# Altium schematic sheet SH-C30L-V1.0.SchDoc
size 420 x 298 mm; Symbol: Sheet-Symbol_A3; Company: DSD TECH; @Page No: 1; @Page Name: P1; @Project Name: SH-C30L; @Page Count: 1; @Update Date: 2024-11-15; @Create Date: 2024-11-15; @Schematic Name: CANable_V1.0; Device: Sheet-Symbol_A3; @Board Name: SH-C30L-V1.0-20241115; @Create Time: 15:35:04; @Update Time: 15:35:04
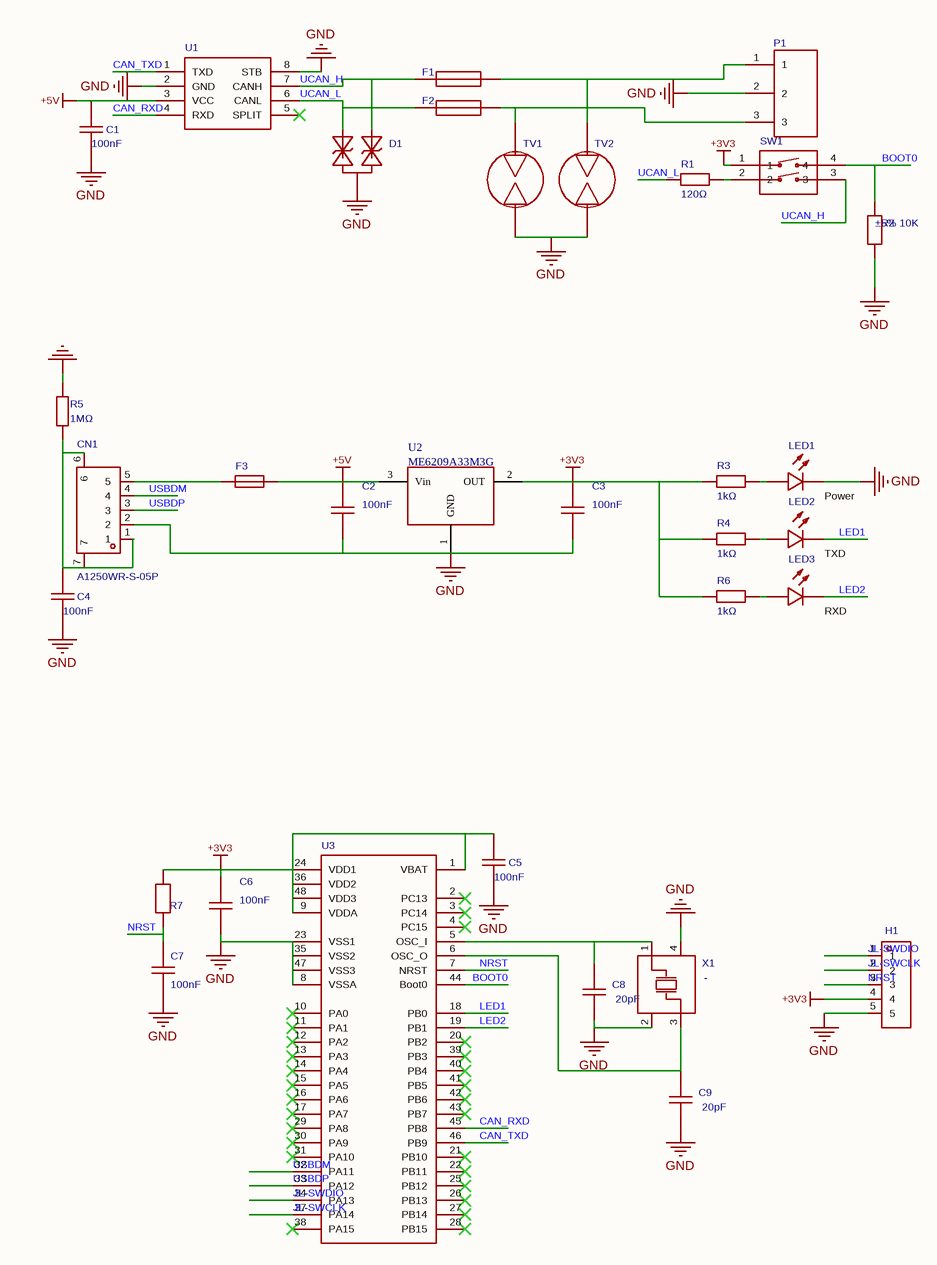
[diagram p0: SH-C30L-V1.0.SchDoc]

## Parts
C1  value 100nF  [C0402]
C2  value 100nF  [C0402]
C3  value 100nF  [C0402]
C4  value 100nF  [C0402]
C5  value 100nF  [C0402]
C6  value 100nF  [C0402]
C7  value 100nF  [C0402]
C8  value 20pF  [C0402]
C9  value 20pF  [C0402]
CN1  A1250WR-S-05P  [CONN-SMD_HF-P1.25-5P]
D1  (no value)  [SOT-23-3_L2.9-W1.3-P1.90-LS2.4-BR]
F1  (no value)  [F1206]
F2  (no value)  [F1206]
F3  (no value)  [F0805]
H1  (no value)  [HDR-TH_5P-P2.54-V-M]
LED1  (no value)  [LED0603-RD_RED]
LED2  (no value)  [LED0603-RD]
LED3  (no value)  [LED0603-RD]
P1  (no value)  [CONN-TH_3P-P3.81_WJ124-3.81-3P]
R1  value 120Ω  [R0805]
R2  LCSC Part Name: ±5% 10K  [R0402]
R3  value 1kΩ  [R0402]
R4  value 1kΩ  [R0402]
R5  value 1MΩ  [R0603]
R6  value 1kΩ  [R0402]
R7  (no value)  [R0402]
SW1  (no value)  [SW-SMD_4P-L6.5-W6.0-P2.54-LS9.8]
TV1  (no value)  [DIO-DT-SMD_L4.5-W3.2]
TV2  (no value)  [DIO-DT-SMD_L4.5-W3.2]
U1  (no value)  [SOIC-8_L5.0-W4.0-P1.27-LS6.0-BL]
U2  ME6209A33M3G  [SOT-23(SOT-23-3)]
U3  (no value)  [LQFP-48_L7.0-W7.0-P0.50-LS9.0-BL]
X1  (no value)  [OSC-SMD_4P-L3.2-W2.5-BL]

## Nets
+3V3: C3.2 C5.2 C6.2 H1.4 R3.1 R4.1 R6.1 R7.2 SW1.1 U2.2(OUT) U3.1(VBAT) U3.9(VDDA) U3.24(VDD1) U3.36(VDD2) U3.48(VDD3)
+5V: C1.2 C2.2 F3.2 U1.3(VCC) U2.3(Vin)
GND: C1.1 C2.1 C3.1 C4.1 C5.1 C6.1 C7.1 C8.2 C9.1 CN1.2 D1.3 H1.5 LED1.1(K) P1.2 R2.1 R5.1 TV1.2 TV2.2 U1.2(GND) U1.8(STB) U2.1(GND) U3.8(VSSA) U3.23(VSS1) U3.35(VSS2) U3.47(VSS3) X1.2(GND) X1.4(GND)
BOOT0: R2.2 SW1.4 U3.44(Boot0)
CAN_RXD: U1.4(RXD) U3.45(PB8)
CAN_TXD: U1.1(TXD) U3.46(PB9)
JL-SWCLK: H1.2 U3.37(PA14)
JL-SWDIO: H1.1 U3.34(PA13)
LED1: LED2.1(K) U3.18(PB0)
LED2: LED3.1(K) U3.19(PB1)
NRST: C7.2 H1.3 R7.1 U3.7(NRST)
UCAN_H: D1.1 F1.1 SW1.3 U1.7(CANH)
UCAN_L: D1.2 F2.1 R1.1 U1.6(CANL)
USBDM: CN1.4 U3.32(PA11)
USBDP: CN1.3 U3.33(PA12)
NetC4_2: C4.2 CN1.1 CN1.6 CN1.7 R5.2
NetC8_1: C8.1 U3.5(OSC_I) X1.1(OSC1)
NetC9_2: C9.2 U3.6(OSC_O) X1.3(OSC2)
NetCN1_5: CN1.5 F3.1
NetF1_2: F1.2 P1.1 TV2.1
NetF2_2: F2.2 P1.3 TV1.1
NetLED1_2: LED1.2(A) R3.2
NetLED2_2: LED2.2(A) R4.2
NetLED3_2: LED3.2(A) R6.2
NetR1_2: R1.2 SW1.2

Not connected (* = marked no-connect by the designer): U1 5(SPLIT)*; U3 2(PC13)* 3(PC14)* 4(PC15)* 10(PA0)* 11(PA1)* 12(PA2)* 13(PA3)* 14(PA4)* 15(PA5)* 16(PA6)* 17(PA7)* 20(PB2)* 21(PB10)* 22(PB11)* 25(PB12)* 26(PB13)* 27(PB14)* 28(PB15)* 29(PA8)* 30(PA9)* 31(PA10)* 38(PA15)* 39(PB3)* 40(PB4)* 41(PB5)* 42(PB6)* 43(PB7)*

## Notes on the sheet
- (near LED1) Power
- (near LED2) TXD
- (near LED3) RXD
- Update Date
- 2024-11-15
- Schematic
- Page
- CANable_V1.0
- P1
- Create Date
- Part Number
- Reviewed
- Drawed
- SH-C30L
- VER
- SIZE
- PAGE
- 1
- DSD TECH
- OF

## Library data of the parts
C1-C7 = C0402X104K050T: Capacitance:100nF;Tolerance:±10%;Rated Voltage:50V;Temp. Coefficient:X7R;; Manufacturer: IHHEC; AddInBom: yes; ModelId: 36a51122f27c49738f86b3bfa98863e0; ModelName: C0402_L1.0-W0.5-H0.5; ModelTransform: 39.37,19.685,0,0,0,0,0,0,0; Tolerance: ±10%; Voltage Rated: 50V; Temperature Coefficient: X7R; Device: C0402X104K050T; Symbol: C0402X104K050T; LCSC Part Name: 100nF ±10% 50V; SupplierPart: C501838; ManufacturerPart: C0402X104K050T; Supplier Footprint: 0402; JLCPCB Part Class: Extended Part; Datasheet: https://atta.szlcsc.com/upload/public/pdf/source/20190313/C374174_331C86E4A68CC9C732DA87186AAF7F8A.pdf; Supplier: LCSC; ConvertToPcb: yes; FootprintName: C0402
C8 C9 = GRM1555C1H200JA01D: Capacitance:20pF;Tolerance:±5%;Rated Voltage:50V;Temp. Coefficient:C0G;; Manufacturer: muRata; AddInBom: yes; ModelId: 36a51122f27c49738f86b3bfa98863e0; ModelName: C0402_L1.0-W0.5-H0.5; ModelTransform: 39.37,19.685,0,0,0,0,0,0,0; Tolerance: ±5%; Voltage Rated: 50V; Temperature Coefficient: C0G; Device: GRM1555C1H200JA01D; Symbol: GRM1555C1H200JA01D; LCSC Part Name: 20pF ±5% 50V; SupplierPart: C76959; ManufacturerPart: GRM1555C1H200JA01D; Supplier Footprint: 0402; JLCPCB Part Class: Extended Part; Datasheet: https://atta.szlcsc.com/upload/public/pdf/source/20180307/C76959_15204091273971407747.pdf; Supplier: LCSC; ConvertToPcb: yes; FootprintName: C0402
CN1 = A1250WR-S-05P: Pin Configuration:1x5P;Pitch:1.25mm;Mounting:-;Reference Series:-;Total Pins:5P;Rows:1;Pins per Row:5;Row Spacing:-;Contact Material:Phosphor Bronze;; Manufacturer: HR; AddInBom: yes; ModelId: 1add2430d4ef47bf9b16807c94307513; ModelName: CONN-SMD_MX1.25-WS-5P; ModelTransform: 448.818,204.3303,0,0,0,0,0,-31.496,0; Pins Structure: 1x5P; Pitch: 1.25mm; Number of PINs Per Row: 5; Symbol: A1250WR-S-05P; Device: A1250WR-S-05P; LCSC Part Name: Pitch:1.25mm 1x5P; SupplierPart: C267482; ManufacturerPart: A1250WR-S-05P; Supplier Footprint: SMD,P=1.25mm; JLCPCB Part Class: Extended Library; Datasheet: https://atta.szlcsc.com/upload/public/pdf/source/20180810/C267488_FB35E328194EC1D336731540BB5C61F9.pdf; Supplier: LCSC; ConvertToPcb: yes; FootprintName: CONN-SMD_HF-P1.25-5P; Mounting Style: -; Reference Series: -; Number of Pins: 5P; Number of Rows: 1; Row Spacing: -; Contact Material: Phosphor Bronze
D1 = TPPESD12VL2BT: Manufacturer: TECH PUBLIC; AddInBom: yes; ModelId: c62791f0466c4ae2a892c056b845b0ca; ModelName: SOT-23-3P_L2.9-W1.3-H1.0-LS2.4-P0.95; ModelTransform: 98.425,114.173,0,180,0,0,0.0005,-0.0005,0; Device: TPPESD12VL2BT; Symbol: TPPESD12VL2BT; LCSC Part Name: TPPESD12VL2BT; SupplierPart: C2682273; ManufacturerPart: TPPESD12VL2BT; Supplier Footprint: SOT-23-3; JLCPCB Part Class: Extended Part; Datasheet: https://atta.szlcsc.com/upload/public/pdf/source/20210810/22D0EE7AE03C1C968B9C50DDF599EB08.pdf; Supplier: LCSC; ConvertToPcb: yes; FootprintName: SOT-23-3_L2.9-W1.3-P1.90-LS2.4-BR
F1 F2 = BSMD1206-020-24V: Max Voltage:24V;Hold Current:200mA;Max Current:40A;Power Dissipation:600mW;Operating Temp.:-40~+85;Trip Current:460mA;Initial Resistance (min):350mΩ;Max Trip Time:100ms;Post-trip Resistance (max):2.7Ω;; Manufacturer: BHFUSE; AddInBom: yes; ModelId: f1628daad26847a79b887277a2bc8541; ModelName: F1206_L3.2-W1.7-H0.6; ModelTransform: 126,66.9,0,0,0,0,0,0,0; Operating Voltage (Max): 24V; Hold Current: 200mA; Current Rating (Max): 40A; Power Dissipation: 600mW; Trip Current: 460mA; Resistance - Initial (Ri) (Min): 350mΩ; Maximum Time to Trip: 100ms; Resistance - Post Trip (R1) (Max): 2.7Ω; Operating Temperature: -40~+85; Device: BSMD1206-020-24V; Symbol: BSMD1206-020-24V; LCSC Part Name: 1206 0.2A 24V; SupplierPart: C883117; ManufacturerPart: BSMD1206-020-24V; Supplier Footprint: 1206; JLCPCB Part Class: Extended Part; Datasheet: https://atta.szlcsc.com/upload/public/pdf/source/20210323/C976306_14EC47BF6884C9FF1739F1E3CC0B530C.pdf; Supplier: LCSC; ConvertToPcb: yes; FootprintName: F1206
F3 = FSMD010-24-0805-R: Max Voltage:24V;Max Current:100A;Hold Current:100mA;Trip Current:300mA;; Manufacturer: FUZETEC; AddInBom: yes; ModelId: 57e2aa106f9143e8b6ab832aebb31c78; ModelName: F0805_L2.1-W1.4-H0.8; ModelTransform: 82.677,55.118,0,0,0,0,0.0005,0,0; Operating Voltage (Max): 24V; Current Rating (Max): 100A; Hold Current: 100mA; Trip Current: 300mA; Device: FSMD010-24-0805-R; Symbol: FSMD010-24-0805-R; LCSC Part Name: 0.1A 24V resettable fuse; SupplierPart: C220142; ManufacturerPart: FSMD010-24-0805-R; Supplier Footprint: 0805; JLCPCB Part Class: Extended Part; Datasheet: https://atta.szlcsc.com/upload/public/pdf/source/20180530/C220142_CDCC5931C174CCAFFDB29D784E09FABB.PDF; Supplier: LCSC; ConvertToPcb: yes; FootprintName: F0805
H1 = PZ254V-11-05P: Pitch:2.54mm;Total Pins:5;Rows:1;Pin Configuration:1x5P;Row Spacing:-;Mounting Type:Through Hole;Round Pin/Square Pin:Square Pin;Rated Current:-;Rated Voltage:-;Mating Pin Length:6mm;Insulator Height:2.5mm;Termination Pin Length:3mm;Contact Material:Brass;Contact Plating:-;Operating Temp. Range:-40~+105;Color:Black;; Manufacturer: XFCN; AddInBom: yes; ModelId: 47d466e4a34f4fc5bc626cf773a24dd5; ModelName: HDR-TH_5P-P2.54-M-LI-1X5P; ModelTransform: 499.999,100,0,0,0,0,0,0,-118.11; Pitch: 2.54mm; Pin Structure: 1x5P; Operating Temperature Range: -40~+105; Device: PZ254V-11-05P; Symbol: PZ254V-11-05P; LCSC Part Name: 2.54mm 1x5P; SupplierPart: C492404; ManufacturerPart: PZ254V-11-05P; Supplier Footprint: Through Hole,P=2.54mm; JLCPCB Part Class: Extended Part; Datasheet: https://atta.szlcsc.com/upload/public/pdf/source/20200309/C492404_E51533260F8710EFF5D4617281164C1D.pdf; Supplier: LCSC; ConvertToPcb: yes; FootprintName: HDR-TH_5P-P2.54-V-M; Number of Pins: 5; Number of Rows: 1; Row Spacing: -; Mounting Type: Through Hole; Circluar Pins/Square Pins: Square Pin; Current Rating (Max): -; Voltage Rating (Max): -; Length of Mating Pin: 6mm; Insulation Height: 2.5mm; Length of End Connection Pin: 3mm; Contact Material: Brass; Contact Plating: -; Color: Black
LED1 = NCD0603R1_C84263: Emitted Color:Red;; Manufacturer: NationStar; Symbol: FC-DA1608HRK-620D; AddInBom: yes; ModelId: 74041d3a270d435c8600a9ab9b7641c0; ModelTransform: 63.7794,31.496,0,0,0,0,0,0,0; Emitted Color: Red; Device: NCD0603R1_C84263; LCSC Part Name: Red; SupplierPart: C84263; ManufacturerPart: NCD0603R1; Supplier Footprint: 0603; JLCPCB Part Class: Extended Part; Datasheet: https://atta.szlcsc.com/upload/public/pdf/source/20200820/C84263_DABC6A75E58F576973B407FDBA283D60.pdf; Supplier: LCSC; ConvertToPcb: yes; FootprintName: LED0603-RD_RED; ModelName: LED0603-RD_RED
LED2 LED3 = NCD0603G1: Emitted Color:Emerald Green;; Manufacturer: NationStar; Symbol: FC-D1608UGK-520D10; AddInBom: yes; ModelId: 1f0d29a91be547639d425604e9b96ebb; ModelTransform: 63.7794,32.283,0,0,0,0,0,0,0; Device: NCD0603G1; LCSC Part Name: Emerald Green; SupplierPart: C84267; ManufacturerPart: NCD0603G1; Supplier Footprint: 0603; JLCPCB Part Class: Extended Part; Datasheet: https://atta.szlcsc.com/upload/public/pdf/source/20200820/C84267_04BA7703640BAC111D09F5EFB971FBF3.pdf; Supplier: LCSC; ConvertToPcb: yes; FootprintName: LED0603-RD; ModelName: LED0603-RD; Emitted Color: Emerald Green
P1 = WJ124-3.81-3P: Pitch:3.81mm;Rows:1;Pins per Row:3;Mounting:Straight;Rated Current:15A;Rated Voltage:300V;Wire Gauge - AWG:14~30;Wire Gauge - mm?:1.5;Operating Temp. Range:-40~+105;Color:Green;; Manufacturer: KANGNEX; AddInBom: yes; ModelId: 09065bb11f2443318818d6a3b154f95c; ModelName: CONN-TH_WJ3.81-LI-3P-124; ModelTransform: 469.7,287.4,0,90,0,0,2,-9.8,-157.5; Pitch: 3.81mm; Number of PINs Per Row: 3; Current Rating (Max): 15A; Voltage Rating (Max): 300V; Wire Gauge - AWG: 14~30; Wire Gauge - mm?: 1.5; Operating Temperature Range: -40~+105; Device: WJ124-3.81-3P; Symbol: WJ124-3.81-3P; LCSC Part Name: 3.81mm Rows:1 Pins per Row:3 Straight stackable; SupplierPart: C36780; ManufacturerPart: WJ124-3.81-3P; Supplier Footprint: P=3.81mm; JLCPCB Part Class: Extended Part; Datasheet: https://atta.szlcsc.com/upload/public/pdf/source/20191225/C36780_C6A965E5CD5B8ACE599A8EDC0C9E48CC.pdf; Supplier: LCSC; ConvertToPcb: yes; FootprintName: CONN-TH_3P-P3.81_WJ124-3.81-3P; Number of Rows: 1; Mounting Style: Straight; Color: Green
R1 = TC0525F1200T5E: Resistor Type:Thin Film Resistor;Resistance:120Ω;Tolerance:±1%;Power:250mW;Temp. Coefficient:±25ppm/;Max Working Voltage:150V;Operating Temp. Range:-55~+155;; Manufacturer: UNI-ROYAL; Temperature Coefficient: ±25ppm/; AddInBom: yes; ModelId: 37a81e68749a4138bd2dfa6897b24b85; ModelName: R0805_L2.0-W1.3-H0.6; ModelTransform: 78.74,51.181,0,0,0,0,0,-0.0005,0; Tolerance: ±1%; Power(Watts): 250mW; Overload Voltage (Max): 150V; Operating Temperature Range: -55~+155; Device: TC0525F1200T5E; Symbol: TC0525F1200T5E; LCSC Part Name: 120Ω ±1%; SupplierPart: C61683; ManufacturerPart: TC0525F1200T5E; Supplier Footprint: 0805; JLCPCB Part Class: Extended Part; Datasheet: https://atta.szlcsc.com/upload/public/pdf/source/20190404/C61683_83EF7BF6E2DB2C00969A8D3769A56445.pdf; Supplier: LCSC; ConvertToPcb: yes; FootprintName: R0805; Type: Thin Film Resistor
R2 R7 = SCR0402J10K: Manufacturer: VO; AddInBom: yes; ModelId: 671aefced39d4c318694bba8bd8efd39; ModelName: R0402_L1.0-W0.5-H0.5; ModelTransform: 39.37,19.685,0,0,0,0,0,0.0005,0; Device: SCR0402J10K; Symbol: SCR0402J10K; SupplierPart: C3017497; ManufacturerPart: SCR0402J10K; Supplier Footprint: 0402; JLCPCB Part Class: Extended Part; Datasheet: https://atta.szlcsc.com/upload/public/pdf/source/20220513/247AF9639BA21CF93567DC289CCC6A22.pdf; Supplier: LCSC; ConvertToPcb: yes; FootprintName: R0402
  R7: LCSC Part Name: ±5% 10K
R3 R4 R6 = RC0402JR-071KL: Resistance:1kΩ;Tolerance:±5%;Power:1/16W;Temp. Coefficient:±100ppm/;Max Working Voltage:50V;Operating Temp. Range:-55~+155;; Manufacturer: YAGEO; AddInBom: yes; ModelId: 671aefced39d4c318694bba8bd8efd39; ModelName: R0402_L1.0-W0.5-H0.5; ModelTransform: 39.37,19.685,0,0,0,0,0,0.0005,0; Tolerance: ±5%; Power(Watts): 1/16W; Overload Voltage (Max): 50V; Device: RC0402JR-071KL; Temperature Coefficient: ±100ppm/; Operating Temperature Range: -55~+155; Symbol: RC0402JR-071KL; LCSC Part Name: 1kΩ ±5%; SupplierPart: C105637; ManufacturerPart: RC0402JR-071KL; Supplier Footprint: 0402; JLCPCB Part Class: Extended Part; Datasheet: https://atta.szlcsc.com/upload/public/pdf/source/20170518/1495085707603.pdf; Supplier: LCSC; ConvertToPcb: yes; FootprintName: R0402
R5 = 0603WAJ0105T5E: Resistor Type:Thick Film Resistor;Resistance:1MΩ;Tolerance:±5%;Power:1/10W;Temp. Coefficient:±100ppm/;Max Working Voltage:75V;Operating Temp. Range:-55~+155;; Manufacturer: UNI-ROYAL; AddInBom: yes; ModelId: 3281a289d46d4bb1877be1eabd090e13; ModelName: R0603_L1.6-W0.8-H0.8; ModelTransform: 62.992,31.496,0,0,0,0,0,0,0; Tolerance: ±5%; Power(Watts): 1/10W; Overload Voltage (Max): 75V; Temperature Coefficient: ±100ppm/; Operating Temperature Range: -55~+155; Device: 0603WAJ0105T5E; Symbol: 0603WAJ0105T5E; LCSC Part Name: 1MΩ ±5%; SupplierPart: C26098; ManufacturerPart: 0603WAJ0105T5E; Supplier Footprint: 0603; JLCPCB Part Class: Extended Part; Datasheet: https://atta.szlcsc.com/upload/public/pdf/source/20200306/C422600_1E6D84923E4A46A82E41ADD87F860B5C.pdf; Supplier: LCSC; ConvertToPcb: yes; FootprintName: R0603; Type: Thick Film Resistor
SW1 = NPM-02-V-T/R: SMD DIP switch, 2.54mm pitch, 2 positions, side-actuated long lever; AddInBom: yes; ModelId: dc9ff7affaf54305afb2aaa1f48b2382; ModelTransform: 255.1176,385.826,0,0,0,0,0,-13.779,0; Device: NPM-02-V-T/R; Symbol: NPM-02-V-T/R; LCSC Part Name: 2-position SMD DIP switch; SupplierPart: C501603; ManufacturerPart: NPM-02-V-T/R; Supplier Footprint: SMD; JLCPCB Part Class: Extended Part; Datasheet: https://atta.szlcsc.com/upload/public/pdf/source/20200324/C501603_F75A0033AA4F50EBB55FC75491E42802.pdf; Supplier: LCSC; ConvertToPcb: yes; FootprintName: SW-SMD_4P-L6.5-W6.0-P2.54-LS9.8; ModelName: SW-SMD_4P-L6.5-W6.0-P2.54-LS9.8
TV1 TV2 = SMD4532-090NF: Electrodes:2;DC Breakdown Voltage:90V;Tolerance:±30%;Pulse Discharge Current:3kA;Interelectrode Capacitance:0.5pF;; Manufacturer: RUILON; AddInBom: yes; ModelId: 3e98048e62f042eda67deea78d2be460; ModelName: DIO-DT_L4.5-W3.2-H2.7; ModelTransform: 177.2,126,0,0,0,0,0,0,0; Number of Poles: 2; DC Spark-over Voltage: 90V; Tolerance: ±30%; Nominal Impulse Discharge Current: 3kA; Maximum Capacitance @ 1MHz: 0.5pF; Device: SMD4532-090NF; Symbol: SMD4532-090NF; LCSC Part Name: 90V; SupplierPart: C9235; ManufacturerPart: SMD4532-090NF; Supplier Footprint: 1812; JLCPCB Part Class: Extended Part; Datasheet: https://atta.szlcsc.com/upload/public/pdf/source/20140725/1457707194440.pdf; Supplier: LCSC; ConvertToPcb: yes; FootprintName: DIO-DT-SMD_L4.5-W3.2
U1 = TJA1040T/CM,118: Type:Transceiver;Protocol:CAN Bus;; Manufacturer: NXP; AddInBom: yes; ModelId: e81d2f7d937b4a6ab1dca543ff5d56a4; ModelName: SOIC-8_L4.9-W3.9-H1.7-LS6.0-P1.27; ModelTransform: 189.751,236.22,0,0,0,0,-0.0005,0.0005,0; Protocol: CAN Bus; Supply Voltage: 4.75V ~ 5.25V; Device: TJA1040T/CM,118; Symbol: TJA1040T/CM,118; LCSC Part Name: TJA1040T/CM,118; SupplierPart: C6951; ManufacturerPart: TJA1040T/CM,118; Supplier Footprint: SOIC-8_150mil; JLCPCB Part Class: Extended Part; Datasheet: https://atta.szlcsc.com/upload/public/pdf/source/20140819/1457707229647.pdf; Supplier: LCSC; ConvertToPcb: yes; FootprintName: SOIC-8_L5.0-W4.0-P1.27-LS6.0-BL; Type: Transceiver
U2 = ME6209A33M3G: ConvertToPcb: yes; Origin Footprint: SOT-23(SOT-23-3); Device: ME6209A33M3G; Symbol: ME6209A33M3G; AddInBom: yes
U3 = STM32F072C8T6: CPU Core:ARM® Cortex®-M0;Supply Voltage:1.65V ~ 3.6V;; Manufacturer: ST; AddInBom: yes; ModelId: 093be70396ff421eb2cdb946d5311efc; ModelName: LQFP-48_L7.0-W7.0-H1.4-LS9.0-P0.50; ModelTransform: 354.331,354.331,0,0,0,0,0,0,0; Program Memory Size: 64KB; RAM Size: 16KB; Number of I/O: 37; A/D: 10x12bit; D/A: 2x12bit; PWM: 6; UART/USART: 4 USART; I2C (SMBUS/PMBUS): 2; USB Device: 1; Device: STM32F072C8T6; Symbol: STM32F072C8T6; LCSC Part Name: STM32F072C8T6; SupplierPart: C80488; ManufacturerPart: STM32F072C8T6; Supplier Footprint: LQFP-48_7x7x05P; JLCPCB Part Class: Extended Part; Datasheet: https://atta.szlcsc.com/upload/public/pdf/source/20160816/1471343013459.pdf; Supplier: LCSC; ConvertToPcb: yes; FootprintName: LQFP-48_L7.0-W7.0-P0.50-LS9.0-BL; Core Processor: ARM® Cortex®-M0; Voltage - Supply (Vcc/Vdd): 1.65V ~ 3.6V; CAN: 1; Features: I2S,HDMI CEC
X1 = SX32Y024000BC1T: Crystal Type:-;Frequency:-;Frequency Tolerance:-;Frequency Stability:-;Load Capacitance:-;Operating Temp.:-;; Manufacturer: TKD; AddInBom: yes; ModelId: ae22b8d143894765bc8100c37cb6356f; ModelName: OSC-SMD_4P-L3.2-W2.5-H1.0; ModelTransform: 125.984,98.425,0,0,0,0,0,0.005,0; LCSC Part Name: 3225 24M 12PF  10ppm  -20 -75; Value: -; Device: SX32Y024000BC1T; Symbol: SX32Y024000BC1T; SupplierPart: C271629; ManufacturerPart: SX32Y024000BC1T; Supplier Footprint: SMD3225-4P; JLCPCB Part Class: Extended Part; Datasheet: https://atta.szlcsc.com/upload/public/pdf/source/20180829/C271629_CA81D930E8823EB83EE4F79A596DDEFE.pdf; Supplier: LCSC; ConvertToPcb: yes; FootprintName: OSC-SMD_4P-L3.2-W2.5-BL; Crystal Type: -; Frequency Tolerance: -; Frequency Stability: -; Load Capacitance: -; Operating Temperature: -